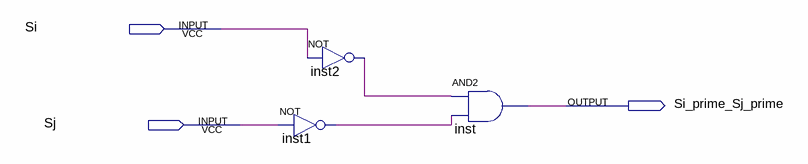
[diagram p0: schematic sheet]
// Quartus schematic Si_prime_Sj_prime.bdf as structural Verilog: 3 symbols, 3 pins
module Si_prime_Sj_prime (
  input  Si,
  input  Sj,
  output Si_prime_Sj_prime
);

  wire inst1_out, inst2_out;

  not inst2 (inst2_out, Si);
  not inst1 (inst1_out, Sj);
  and inst (Si_prime_Sj_prime, inst2_out, inst1_out);
endmodule
